# Altium schematic sheet test_blood_pressure.SchDoc
size A3
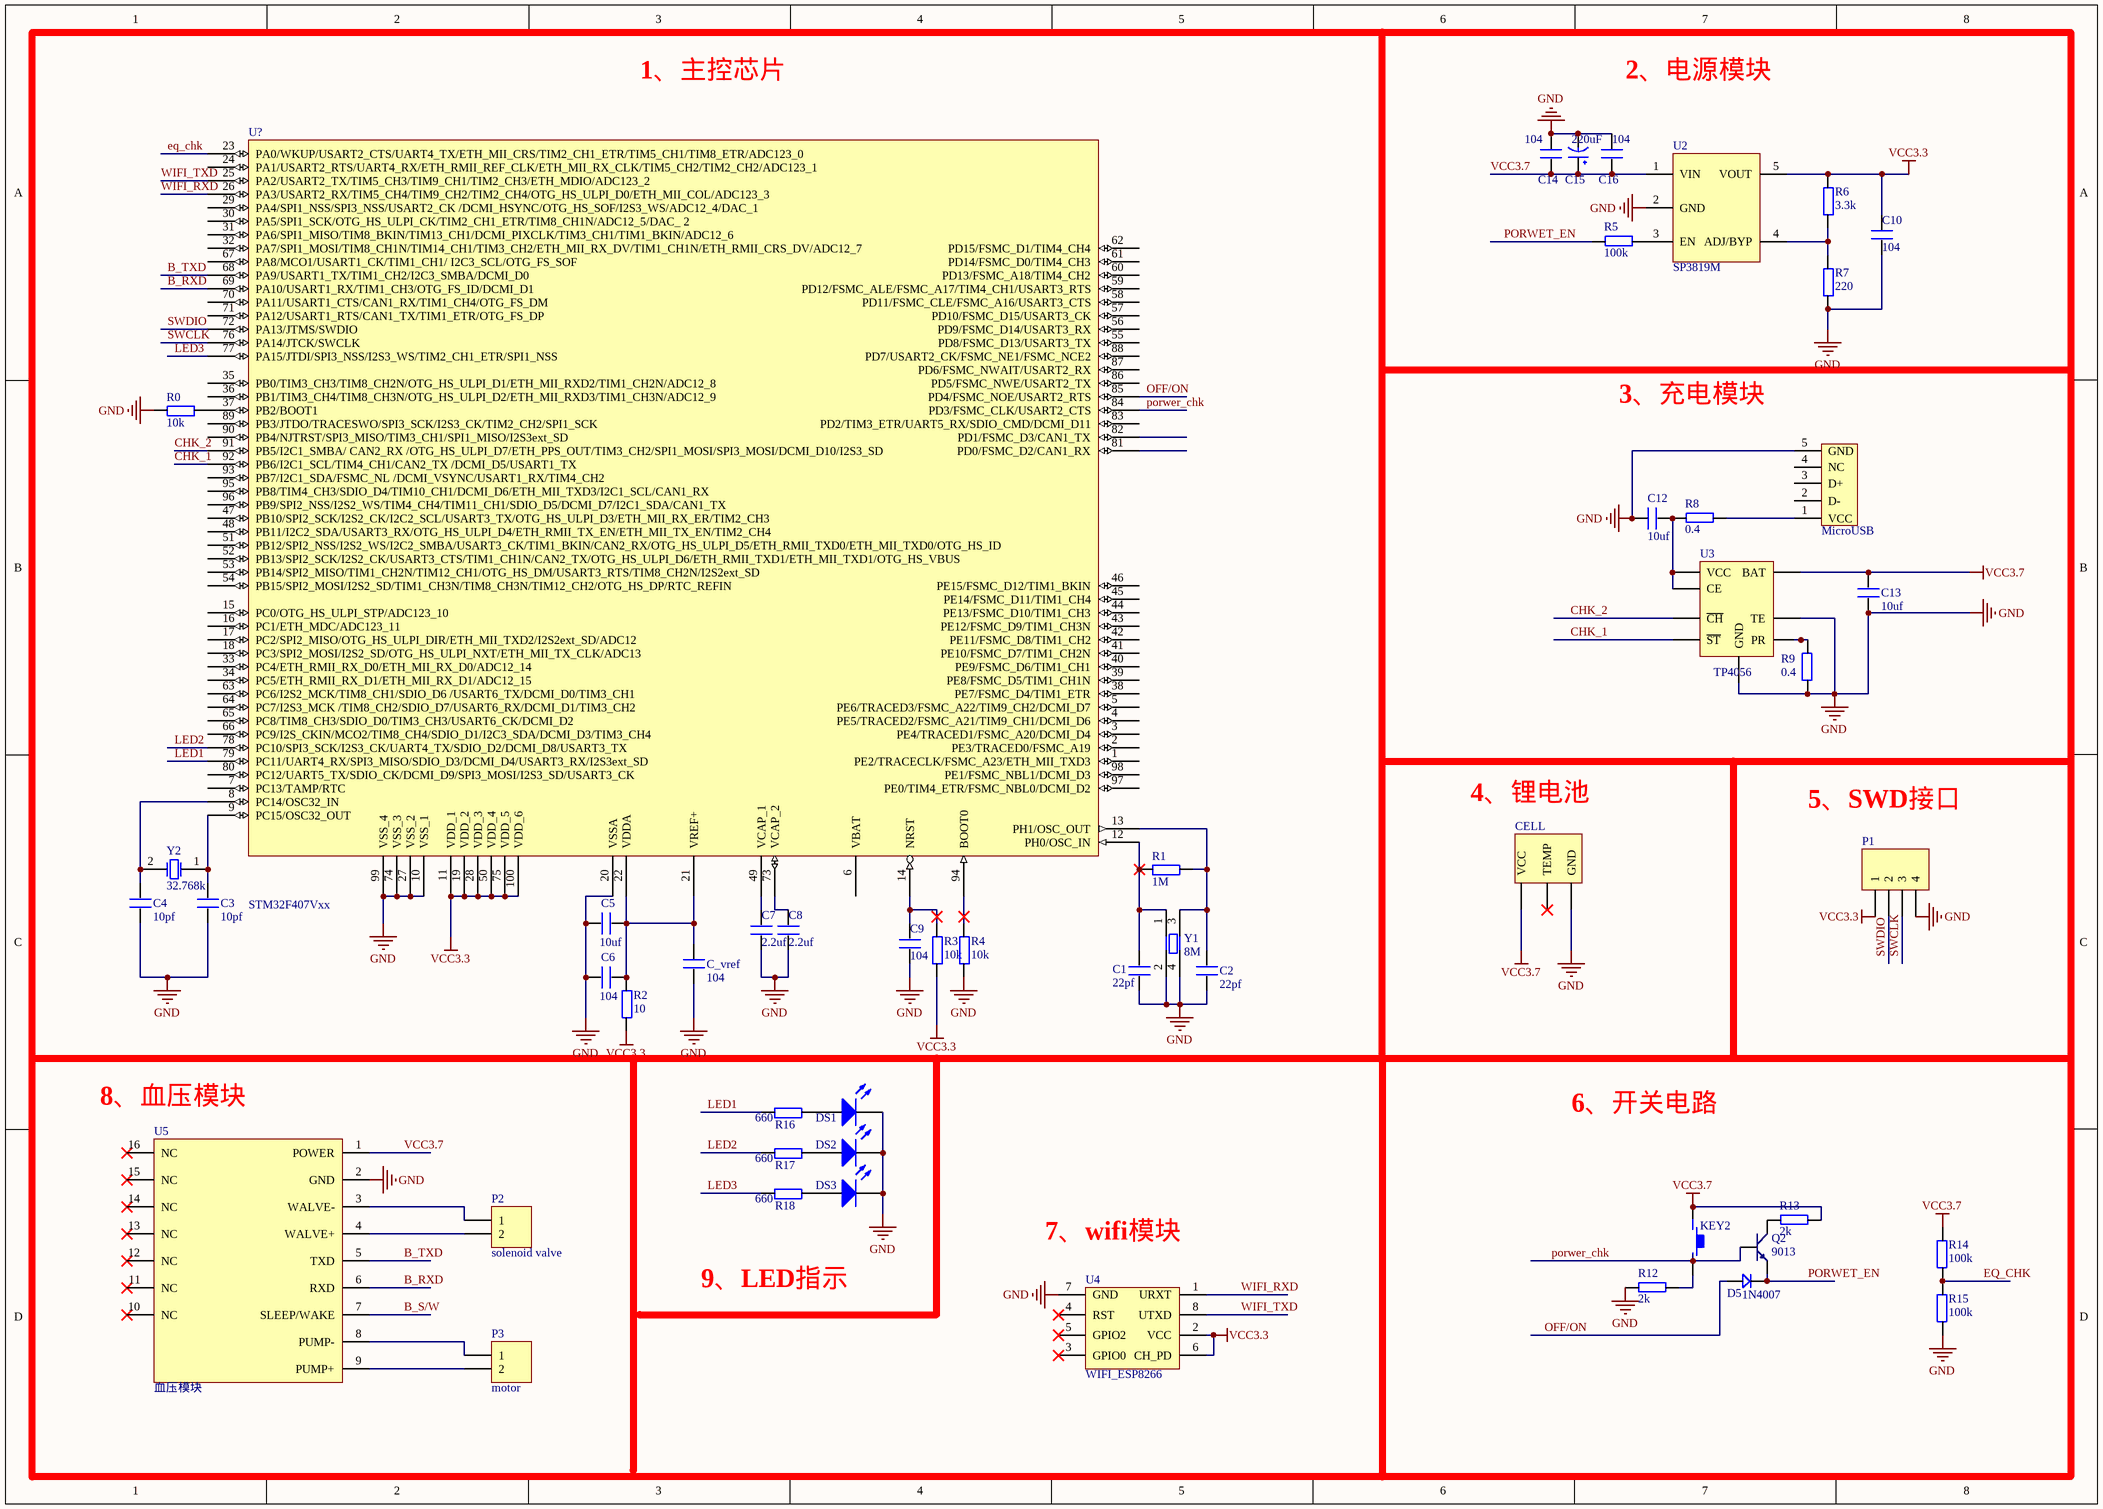
[diagram p0: test_blood_pressure.SchDoc]

## Parts
C1  22pf  [C_0402]
C2  22pf  [C_0402]
C3  10pf  [C_0402]
C4  10pf  [C_0402]
C5  10uf  [C_0402]
C6  104  [C_0402]
C7  2.2uf  [C_0402]
C8  2.2uf  [C_0402]
C9  104  [C_0402]
C10  104  [C_0603]
C12  10uf  [C_0402]
C13  10uf  [C_0402]
C14  104  [C_0402]
C15  220uF  [C_3528]
C16  104  [C_0402]
C_vref  104  [C_0402]
CELL  CELL  [CELL]  (value not drawn)
D5  1N4007  [D_0805]
DS1  LED1  [SMDLED]  (value not drawn)
DS2  LED1  [SMDLED]  (value not drawn)
DS3  LED1  [SMDLED]  (value not drawn)
KEY2  button_2pin  [SMD2_3.5]  (value not drawn)
P1  Header 4  [HDR1X4]  (value not drawn)
P2  solenoid valve  [CELL]
P3  motor  [CELL]
Q2  9013  [SOT-23R]
R0  10k  [R_0402]
R1  1M  [R_0402]
R2  10  [R_0402]
R3  10k  [R_0402]
R4  10k  [R_0402]
R5  100k  [R_0402]
R6  3.3k  [R_0603]
R7  220  [R_0402]
R8  0.4  [R_0603]
R9  0.4  [R_0603]
R12  2k  [R_0402]
R13  2k  [R_0402]
R14  100k  [R_0402]
R15  100k  [R_0402]
R16  660  [R_0603]
R17  660  [R_0603]
R18  660  [R_0603]
U2  SP3819M  [SPX3819]
U3  TP4056  [TP4056]
U4  WIFI_ESP8266  [ESP8266]
U5  血压模块  [血压模块]
U?  STM32F407Vxx
USB1  MicroUSB  [MicroUSB]
Y1  8M  [TXAL_5032]
Y2  32.768k  [TXAL_3215]

## Nets
GND: C1.1 C2.1 C3.2 C4.2 C5.2 C6.2 C7.2 C8.2 C9.2 C10.2 C12.2 C13.1 C14.2 C15.2(GND) C16.2 C_vref.2 CELL.2(GND) DS1.2(K) DS2.2(K) DS3.2(K) P1.4 R0.1 R4.1 R7.1 R9.2 R12.2 R15.2 U2.2(GND) U3.1(TE) U3.3(GND) U4.7(GND) U5.2(GND) U?.10(VSS_1) U?.20(VSSA) U?.27(VSS_2) U?.74(VSS_3) U?.99(VSS_4) USB1.5(GND) Y1.2(GND) Y1.4(GND)
VCC3.3: C10.1 P1.1 R2.1 R3.1 R6.2 U2.5(VOUT) U4.2(VCC) U4.6(CH_PD) U?.11(VDD_1) U?.19(VDD_2) U?.28(VDD_3) U?.50(VDD_4) U?.75(VDD_5) U?.100(VDD_6)
VCC3.7: C13.2 C14.1 C15.1(VCC) C16.1 CELL.1(VCC) KEY2.1(P1) R13.1 R14.1 U2.1(VIN) U3.5(BAT) U5.1(POWER)
B_RXD: U5.6(RXD) U?.69(PA10/USART1_RX/TIM1_CH3/OTG_FS_ID/DCMI_D1)
B_S/W: U5.7(SLEEP/WAKE)
B_TXD: U5.5(TXD) U?.68(PA9/USART1_TX/TIM1_CH2/I2C3_SMBA/DCMI_D0)
CHK_1: U3.6(~{ST}) U?.92(PB6/I2C1_SCL/TIM4_CH1/CAN2_TX_/DCMI_D5/USART1_TX)
CHK_2: U3.7(~{CH}) U?.91(PB5/I2C1_SMBA/_CAN2_RX_/OTG_HS_ULPI_D7/ETH_PPS_OUT/TIM3_CH2/SPI1_MOSI/SPI3_MOSI/DCMI_D10/I2S3_SD)
eq_chk: R14.2 R15.1 U?.23(PA0/WKUP/USART2_CTS/UART4_TX/ETH_MII_CRS/TIM2_CH1_ETR/TIM5_CH1/TIM8_ETR/ADC123_0)
LED1: R16.1 U?.79(PC11/UART4_RX/SPI3_MISO/SDIO_D3/DCMI_D4/USART3_RX/I2S3ext_SD)
LED2: R17.1 U?.78(PC10/SPI3_SCK/I2S3_CK/UART4_TX/SDIO_D2/DCMI_D8/USART3_TX)
LED3: R18.1 U?.77(PA15/JTDI/SPI3_NSS/I2S3_WS/TIM2_CH1_ETR/SPI1_NSS)
OFF/ON: D5.1 U?.85(PD4/FSMC_NOE/USART2_RTS)
porwer_chk: Q2.2(B) U?.84(PD3/FSMC_CLK/USART2_CTS)
PORWET_EN: D5.2 Q2.1(E) R5.2
SWCLK: P1.3 U?.76(PA14/JTCK/SWCLK)
SWDIO: P1.2 U?.72(PA13/JTMS/SWDIO)
WIFI_RXD: U4.1(URXT) U?.26(PA3/USART2_RX/TIM5_CH4/TIM9_CH2/TIM2_CH4/OTG_HS_ULPI_D0/ETH_MII_COL/ADC123_3)
WIFI_TXD: U4.8(UTXD) U?.25(PA2/USART2_TX/TIM5_CH3/TIM9_CH1/TIM2_CH3/ETH_MDIO/ADC123_2)
NetC1_2: C1.2 R1.1 U?.12(PH0/OSC_IN) Y1.1(OSC1)
NetC2_2: C2.2 R1.2 U?.13(PH1/OSC_OUT) Y1.3(OSC2)
NetC3_1: C3.1 U?.9(PC15/OSC32_OUT) Y2.1(OSC1)
NetC4_1: C4.1 U?.8(PC14/OSC32_IN) Y2.2(OSC2)
NetC5_1: C5.1 C6.1 C_vref.1 R2.2 U?.21(VREF+) U?.22(VDDA)
NetC7_1: C7.1 U?.49(VCAP_1)
NetC8_1: C8.1 U?.73(VCAP_2)
NetC9_1: C9.1 R3.2 U?.14(NRST)
NetC12_1: C12.1 R8.2 U3.4(VCC) U3.8(CE)
NetDS1_1: DS1.1(A) R16.2
NetDS2_1: DS2.1(A) R17.2
NetDS3_1: DS3.1(A) R18.2
NetKEY2_2: KEY2.2(P2) R12.1
NetP2_1: P2.1 U5.3(WALVE-)
NetP2_2: P2.2 U5.4(WALVE+)
NetP3_1: P3.1 U5.8(PUMP-)
NetP3_2: P3.2 U5.9(PUMP+)
NetQ2_3: Q2.3(C) R13.2
NetR0_2: R0.2 U?.37(PB2/BOOT1)
NetR4_2: R4.2 U?.94(BOOT0)
NetR5_1: R5.1 U2.3(EN)
NetR6_1: R6.1 R7.2 U2.4(ADJ/BYP)
NetR8_1: R8.1 USB1.1(VCC)
NetR9_1: R9.1 U3.2(PR)

Not connected (* = marked no-connect by the designer): CELL 3(TEMP)*; U4 3(GPIO0)* 4(RST)* 5(GPIO2)*; U5 10(NC)* 11(NC)* 12(NC)* 13(NC)* 14(NC)* 15(NC)* 16(NC)*; U? 1(PE2/TRACECLK/FSMC_A23/ETH_MII_TXD3) 2(PE3/TRACED0/FSMC_A19) 3(PE4/TRACED1/FSMC_A20/DCMI_D4) 4(PE5/TRACED2/FSMC_A21/TIM9_CH1/DCMI_D6) 5(PE6/TRACED3/FSMC_A22/TIM9_CH2/DCMI_D7) 6(VBAT) 7(PC13/TAMP/RTC) 15(PC0/OTG_HS_ULPI_STP/ADC123_10) 16(PC1/ETH_MDC/ADC123_11) 17(PC2/SPI2_MISO/OTG_HS_ULPI_DIR/ETH_MII_TXD2/I2S2ext_SD/ADC12) 18(PC3/SPI2_MOSI/I2S2_SD/OTG_HS_ULPI_NXT/ETH_MII_TX_CLK/ADC13) 24(PA1/USART2_RTS/UART4_RX/ETH_RMII_REF_CLK/ETH_MII_RX_CLK/TIM5_CH2/TIM2_CH2/ADC123_1) 29(PA4/SPI1_NSS/SPI3_NSS/USART2_CK_/DCMI_HSYNC/OTG_HS_SOF/I2S3_WS/ADC12_4/DAC_1) 30(PA5/SPI1_SCK/OTG_HS_ULPI_CK/TIM2_CH1_ETR/TIM8_CH1N/ADC12_5/DAC__2) 31(PA6/SPI1_MISO/TIM8_BKIN/TIM13_CH1/DCMI_PIXCLK/TIM3_CH1/TIM1_BKIN/ADC12_6) 32(PA7/SPI1_MOSI/TIM8_CH1N/TIM14_CH1/TIM3_CH2/ETH_MII_RX_DV/TIM1_CH1N/ETH_RMII_CRS_DV/ADC12_7) 33(PC4/ETH_RMII_RX_D0/ETH_MII_RX_D0/ADC12_14) 34(PC5/ETH_RMII_RX_D1/ETH_MII_RX_D1/ADC12_15) 35(PB0/TIM3_CH3/TIM8_CH2N/OTG_HS_ULPI_D1/ETH_MII_RXD2/TIM1_CH2N/ADC12_8) 36(PB1/TIM3_CH4/TIM8_CH3N/OTG_HS_ULPI_D2/ETH_MII_RXD3/TIM1_CH3N/ADC12_9) 38(PE7/FSMC_D4/TIM1_ETR) 39(PE8/FSMC_D5/TIM1_CH1N) 40(PE9/FSMC_D6/TIM1_CH1) 41(PE10/FSMC_D7/TIM1_CH2N) 42(PE11/FSMC_D8/TIM1_CH2) 43(PE12/FSMC_D9/TIM1_CH3N) 44(PE13/FSMC_D10/TIM1_CH3) 45(PE14/FSMC_D11/TIM1_CH4) 46(PE15/FSMC_D12/TIM1_BKIN) 47(PB10/SPI2_SCK/I2S2_CK/I2C2_SCL/USART3_TX/OTG_HS_ULPI_D3/ETH_MII_RX_ER/TIM2_CH3) 48(PB11/I2C2_SDA/USART3_RX/OTG_HS_ULPI_D4/ETH_RMII_TX_EN/ETH_MII_TX_EN/TIM2_CH4) 51(PB12/SPI2_NSS/I2S2_WS/I2C2_SMBA/USART3_CK/TIM1_BKIN/CAN2_RX/OTG_HS_ULPI_D5/ETH_RMII_TXD0/ETH_MII_TXD0/OTG_HS_ID) 52(PB13/SPI2_SCK/I2S2_CK/USART3_CTS/TIM1_CH1N/CAN2_TX/OTG_HS_ULPI_D6/ETH_RMII_TXD1/ETH_MII_TXD1/OTG_HS_VBUS) 53(PB14/SPI2_MISO/TIM1_CH2N/TIM12_CH1/OTG_HS_DM/USART3_RTS/TIM8_CH2N/I2S2ext_SD) 54(PB15/SPI2_MOSI/I2S2_SD/TIM1_CH3N/TIM8_CH3N/TIM12_CH2/OTG_HS_DP/RTC_REFIN) 55(PD8/FSMC_D13/USART3_TX) 56(PD9/FSMC_D14/USART3_RX) 57(PD10/FSMC_D15/USART3_CK) 58(PD11/FSMC_CLE/FSMC_A16/USART3_CTS) 59(PD12/FSMC_ALE/FSMC_A17/TIM4_CH1/USART3_RTS) 60(PD13/FSMC_A18/TIM4_CH2) 61(PD14/FSMC_D0/TIM4_CH3) 62(PD15/FSMC_D1/TIM4_CH4) 63(PC6/I2S2_MCK/TIM8_CH1/SDIO_D6_/USART6_TX/DCMI_D0/TIM3_CH1) 64(PC7/I2S3_MCK_/TIM8_CH2/SDIO_D7/USART6_RX/DCMI_D1/TIM3_CH2) 65(PC8/TIM8_CH3/SDIO_D0/TIM3_CH3/USART6_CK/DCMI_D2) 66(PC9/I2S_CKIN/MCO2/TIM8_CH4/SDIO_D1/I2C3_SDA/DCMI_D3/TIM3_CH4) 67(PA8/MCO1/USART1_CK/TIM1_CH1/_I2C3_SCL/OTG_FS_SOF) 70(PA11/USART1_CTS/CAN1_RX/TIM1_CH4/OTG_FS_DM) 71(PA12/USART1_RTS/CAN1_TX/TIM1_ETR/OTG_FS_DP) 80(PC12/UART5_TX/SDIO_CK/DCMI_D9/SPI3_MOSI/I2S3_SD/USART3_CK) 81(PD0/FSMC_D2/CAN1_RX) 82(PD1/FSMC_D3/CAN1_TX) 83(PD2/TIM3_ETR/UART5_RX/SDIO_CMD/DCMI_D11) 86(PD5/FSMC_NWE/USART2_TX) 87(PD6/FSMC_NWAIT/USART2_RX) 88(PD7/USART2_CK/FSMC_NE1/FSMC_NCE2) 89(PB3/JTDO/TRACESWO/SPI3_SCK/I2S3_CK/TIM2_CH2/SPI1_SCK) 90(PB4/NJTRST/SPI3_MISO/TIM3_CH1/SPI1_MISO/I2S3ext_SD) 93(PB7/I2C1_SDA/FSMC_NL_/DCMI_VSYNC/USART1_RX/TIM4_CH2) 95(PB8/TIM4_CH3/SDIO_D4/TIM10_CH1/DCMI_D6/ETH_MII_TXD3/I2C1_SCL/CAN1_RX) 96(PB9/SPI2_NSS/I2S2_WS/TIM4_CH4/TIM11_CH1/SDIO_D5/DCMI_D7/I2C1_SDA/CAN1_TX) 97(PE0/TIM4_ETR/FSMC_NBL0/DCMI_D2) 98(PE1/FSMC_NBL1/DCMI_D3); USB1 2(D-) 3(D+) 4(NC)

## Notes on the sheet
- 1、主控芯片
- 2、电源模块
- 3、充电模块
- 4、锂电池
- 5、SWD接口
- (near U5) 8、血压模块
- 6、开关电路
- (near U4) 7、wifi模块
- 9、LED指示

## Library data of the parts
C1-C10 C12-C14 C16 C_vref = C
C15 = CAP
CELL = CELL: 锂电池
D5 = D
DS1-DS3 = LED2: Typical RED, GREEN, YELLOW, AMBER GaAs LED; Published: 8-Jun-2000; LatestRevisionDate: 17-Jul-2002; LatestRevisionNote: Re-released for DXP Platform.; PackageDocument: Feb-2002; PackageReference: 3.2X1.6X1.1; Publisher: Altium Limited
KEY2 = KEY_2
P1 = Header 4: Header, 4-Pin; LatestRevisionDate: 17-Jul-2002; LatestRevisionNote: Re-released for DXP Platform.; Publisher: Altium Limited
P2 P3 = Header 2_1: Header, 2-Pin; LatestRevisionDate: 17-Jul-2002; LatestRevisionNote: Re-released for DXP Platform.; Publisher: Altium Limited
Q2 = NPN: 8050/BCW846/BCW847
R0-R9 R12-R18 = R
U2 = SP3819M: 稳压器
U3 = TP4056: 充电芯片
U4 = WIFI_ESP8266: 安可信wifi模块
USB1 = MicroUSB: 迷你usb接口
Y1 = XTAL_5032/3225
Y2 = XTAL_1: 郑子烁: 肇庆学院